# Altium schematic sheet Peripherals.SchDoc
size Legal
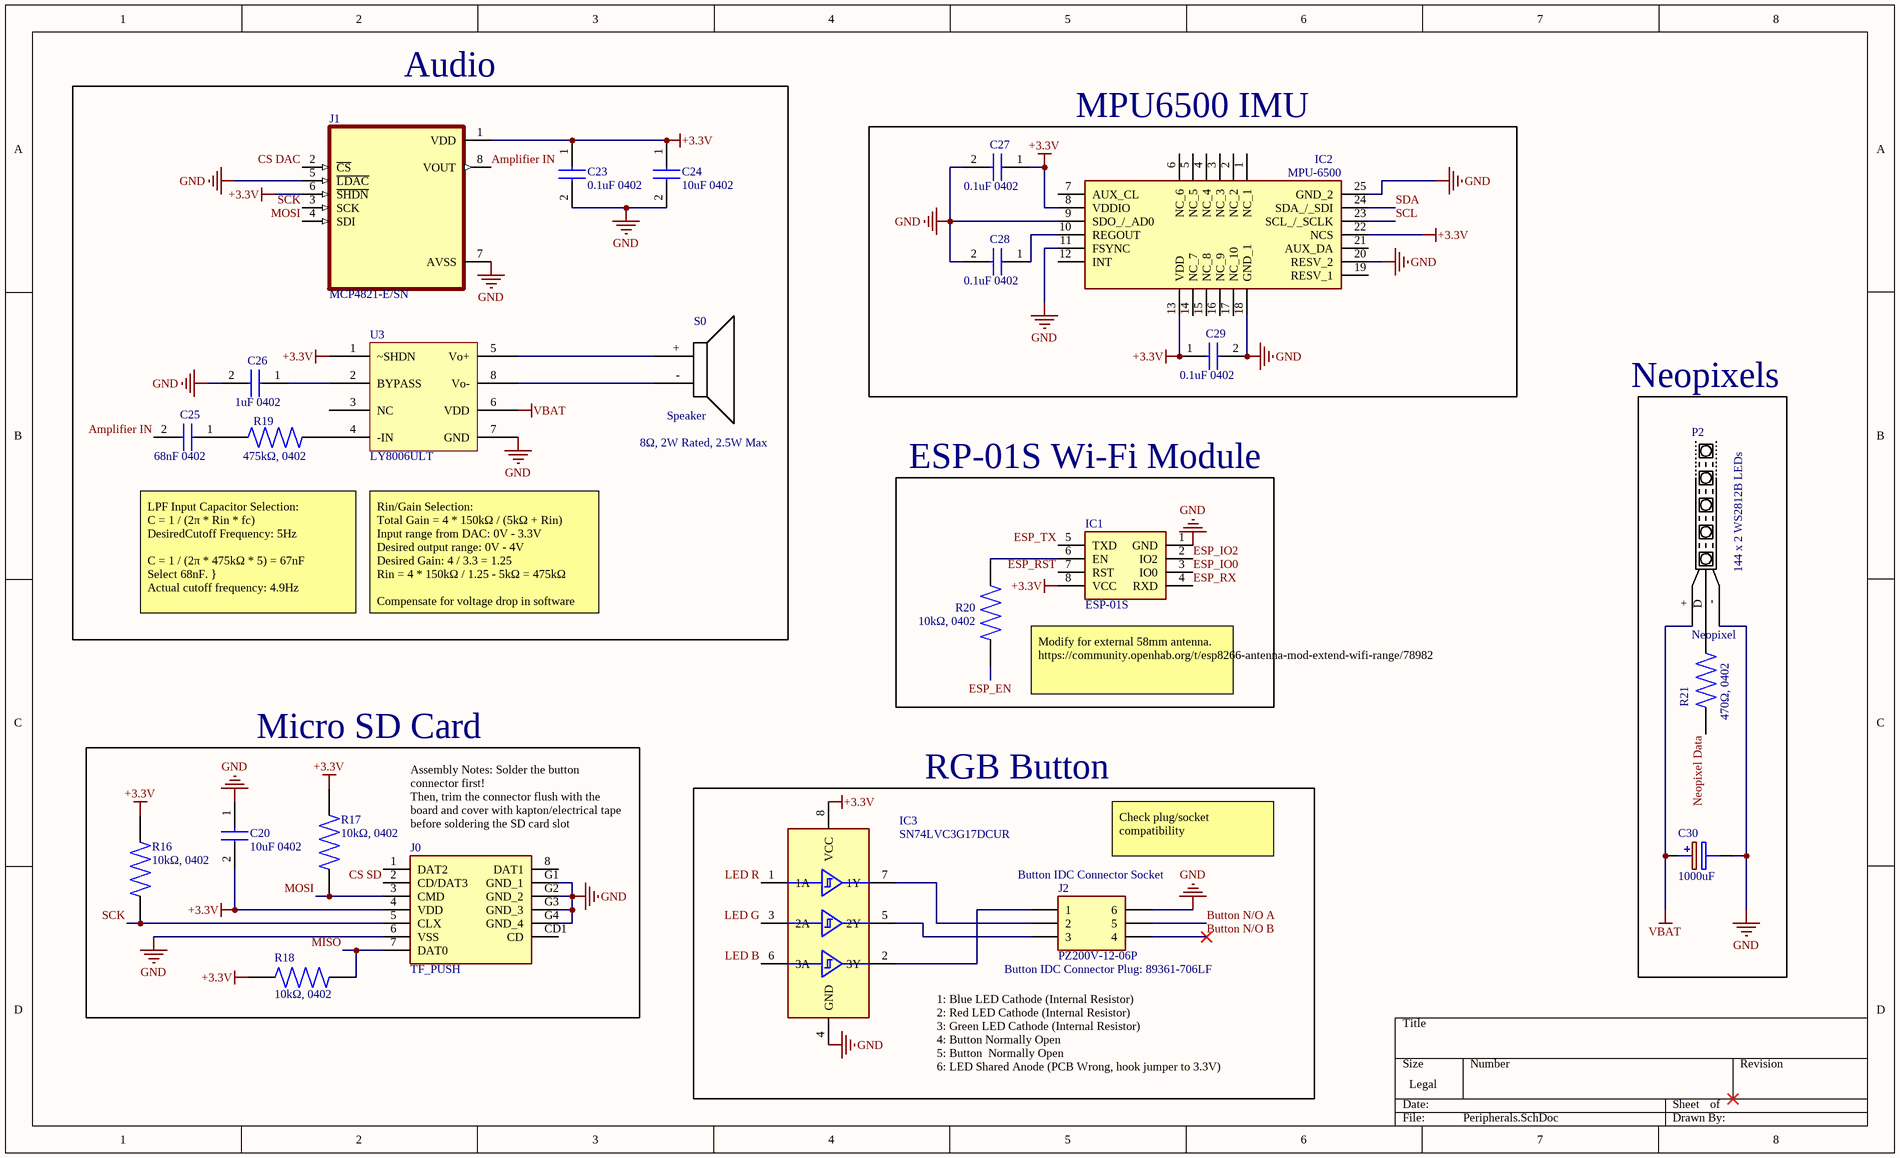
[diagram p0: Peripherals.SchDoc]

## Parts
C20  10uF 0402  [CAPC1005X56N]
C23  0.1uF 0402  [CAPC1005X56N]
C24  10uF 0402  [CAPC1005X56N]
C25  68nF 0402  [CAPC1005X56N]
C26  1uF 0402  [CAPC1005X56N]
C27  0.1uF 0402  [CAPC1005X56N]
C28  0.1uF 0402  [CAPC1005X56N]
C29  0.1uF 0402  [CAPC1005X56N]
C30  1000uF  [8x10.2mm Radial Capacitor]
IC1  ESP-01S  [ESP-01]
IC2  MPU-6500  [QFN-24]
IC3  SN74LVC3G17DCUR  [SOP50P310X90-8N]
J0  TF_PUSH  [TFPUSH]
J1  MCP4821-E/SN  [SOIC127P600X175-8N]
J2  PZ200V-12-06P  [2mm 2x3 Header TH]
P2  Neopixel  [Neopixel Pads]
R16  10kΩ, 0402  [0402]
R17  10kΩ, 0402  [0402]
R18  10kΩ, 0402  [0402]
R19  475kΩ, 0402  [0402]
R20  10kΩ, 0402  [0402]
R21  470Ω, 0402  [0402]
S0  Speaker  [SPEAKER PADS]
U3  LY8006ULT  [MSOP-8]

## Blocks framed on the sheet
Audio: C23-C26 J1 R19 S0 U3
MPU6500 IMU: C27-C29 IC2
Neopixels: C30 P2 R21
ESP-01S Wi-Fi Module: IC1 R20
Micro SD Card: C20 J0 R16-R18
RGB Button: IC3 J2

## Nets
+3.3V: C20.2 C23.1 C24.1 C27.1 C29.1 IC1.8(VCC) IC2.8(VDDIO) IC2.13(VDD) IC2.22(NCS) IC3.8(VCC) J0.4(VDD) J1.1(VDD) J1.6(~{SHDN}) R16.2 R17.2 R18.2 U3.1(~SHDN)
GND: C20.1 C23.2 C24.2 C26.2 C27.2 C28.2 C29.2 C30.2(-) IC1.1(GND) IC2.9(SDO_/_AD0) IC2.11(FSYNC) IC2.18(GND_1) IC2.20(RESV_2) IC2.25(GND_2) IC3.4(GND) J0.6(VSS) J0.G1(GND_1) J0.G2(GND_2) J0.G3(GND_3) J0.G4(GND_4) J1.5(~{LDAC}) J1.7(AVSS) J2.6 P2.- U3.7(GND)
VBAT: C30.1(+) P2.+ U3.6(VDD)
Amplifier IN: C25.2 J1.8(VOUT)
Button N/O A: J2.5
Button N/O B: J2.4
CS DAC: J1.2(~{CS})
CS SD: J0.2(CD/DAT3)
ESP_EN: R20.1
ESP_IO0: IC1.3(IO0)
ESP_IO2: IC1.2(IO2)
ESP_RST: IC1.7(RST)
ESP_RX: IC1.4(RXD)
ESP_TX: IC1.5(TXD)
LED B: IC3.6(3A)
LED G: IC3.3(2A)
LED R: IC3.1(1A)
MISO: J0.7(DAT0) R18.1
MOSI: J0.3(CMD) J1.4(SDI) R17.1
Neopixel Data: R21.2
SCK: J0.5(CLX) J1.3(SCK) R16.1
SCL: IC2.23(SCL_/_SCLK)
SDA: IC2.24(SDA_/_SDI)
NetC25_1: C25.1 R19.1
NetC26_1: C26.1 U3.2(BYPASS)
NetC28_1: C28.1 IC2.10(REGOUT)
NetIC1_6: IC1.6(EN) R20.2
NetIC3_2: IC3.2(3Y) J2.1
NetIC3_5: IC3.5(2Y) J2.3
NetIC3_7: IC3.7(1Y) J2.2
NetP2_D: P2.D R21.1
NetR19_2: R19.2 U3.4(-IN)
NetS0_+: S0.+ U3.5(Vo+)
NetS0_-: S0.- U3.8(Vo-)

Not connected (* = marked no-connect by the designer): IC2 1(NC_1) 2(NC_2) 3(NC_3) 4(NC_4) 5(NC_5) 6(NC_6) 7(AUX_CL) 12(INT) 14(NC_7) 15(NC_8) 16(NC_9) 17(NC_10) 19(RESV_1) 21(AUX_DA); J0 1(DAT2) 8(DAT1) CD1(CD); U3 3(NC)

## Notes on the sheet
- 8Ω, 2W Rated, 2.5W Max
- (near P2) 144 x 2 WS2812B LEDs
- LPF Input Capacitor Selection:
  C = 1 / (2π * Rin * fc)
  DesiredCutoff Frequency: 5Hz
  C = 1 / (2π * 475kΩ * 5) = 67nF
  Select 68nF. }
  Actual cutoff frequency: 4.9Hz
- Rin/Gain Selection:
  Total Gain = 4 * 150kΩ / (5kΩ + Rin)
  Input range from DAC: 0V - 3.3V
  Desired output range: 0V - 4V
  Desired Gain: 4 / 3.3 = 1.25
  Rin = 4 * 150kΩ / 1.25 - 5kΩ = 475kΩ
  Compensate for voltage drop in software
- Modify for external 58mm antenna.
  https://community.openhab.org/t/esp8266-antenna-mod-extend-wifi-range/78982
- (near J0) Assembly Notes: Solder the button connector first!
  Then, trim the connector flush with the board and cover with kapton/electrical tape before soldering the SD card slot
- (near J2) Button IDC Connector Socket
- Check plug/socket compatibility
- (near J2) Button IDC Connector Plug: 89361-706LF
- 1: Blue LED Cathode (Internal Resistor)
  2: Red LED Cathode (Internal Resistor)
  3: Green LED Cathode (Internal Resistor)
  4: Button Normally Open
  5: Button  Normally Open
  6: LED Shared Anode (PCB Wrong, hook jumper to 3.3V)

## Library data of the parts
C20 C23-C29 = 04025A100BAT2A: Capacitor; Manufacturer_Name: AVX; Datasheet Link: http://www.mouser.com/catalog/supplier/library/pdf/AVXSurfaceMountCeramic.pdf; Height: 0.56mm; Manufacturer_Part_Number: 04025A100BAT2A; Arrow Part Number: 04025A100BAT2A; Arrow Price/Stock: https://www.arrow.com/en/products/04025a100bat2a/avx; Mouser Part Number: 581-04025A100B; Mouser Price/Stock: https://www.mouser.com/Search/Refine.aspx?Keyword=581-04025A100B
C30 = 8x10.2mm Radial Capacitor: Capacitor Polarised; Manufacturer_Name: Cinch Connectivity Solutions; Manufacturer_Part_Number: 107CKS035M; Datasheet Link: http://www.farnell.com/datasheets/1912641.pdf; Height: 12.5mm
IC1 = ESP-01S: Integrated Circuit; Manufacturer_Name: Ai-Thinker; Datasheet Link: http://wiki.ai-thinker.com/_media/esp8266/esp8266_series_modules_user_manual_v1.1.pdf; Height: 2mm; Manufacturer_Part_Number: ESP-01
IC2 = MPU-6500: Integrated Circuit; Manufacturer_Name: TDK; Datasheet Link: https://www.invensense.com/wp-content/uploads/2015/02/MPU-6500-Datasheet2.pdf; Height: 0.95mm; Manufacturer_Part_Number: MPU-6500; Arrow Part Number: MPU-6500; Arrow Price/Stock: https://www.arrow.com/en/products/mpu-6500/invensense; Mouser Part Number: 410-MPU-6500
IC3 = SN74LVC3G17DCUR: Integrated Circuit; Manufacturer_Name: Texas Instruments; Datasheet Link: http://www.ti.com/lit/ds/symlink/sn74lvc3g17.pdf; Height: 0.9mm; Manufacturer_Part_Number: SN74LVC3G17DCUR; Arrow Part Number: SN74LVC3G17DCUR; Arrow Price/Stock: https://www.arrow.com/en/products/sn74lvc3g17dcur/texas-instruments; Mouser Part Number: 595-SN74LVC3G17DCUR; Mouser Price/Stock: https://www.mouser.co.uk/ProductDetail/Texas-Instruments/SN74LVC3G17DCUR?qs=0smPjiIwnfJ%2FZmnYCRa%2FdA%3D%3D
J0 = TF_PUSH: Connector; Manufacturer_Name: Shou Han; Manufacturer_Part_Number: TF PUSH; Datasheet Link: https://datasheet.lcsc.com/szlcsc/1912111437_SHOU-HAN-TF-PUSH_C393941.pdf; Height: 2mm
J1 = MCP4821-E/SN: MF: {'manufacturer': u'Microchip'}; MP: MCP4821-E/SN; Price: None; Availability: Unavailable; Value: *; Package: None
J2 = PZ200V-12-06P: Connector; Manufacturer_Name: Amphenol; Manufacturer_Part_Number: 54202-G08-03; Datasheet Link: https://cdn.amphenol-icc.com/media/wysiwyg/files/drawing/54202.pdf; Height: 9.85mm; Arrow Part Number: 54202-G08-03; Arrow Price/Stock: https://www.arrow.com/en/products/54202-g08-03/amphenol-fci; Mouser Part Number: 649-54202-G08-03; Mouser Price/Stock: https://www.mouser.co.uk/ProductDetail/Amphenol-FCI/54202-G08-03?qs=GN3JspNYOhaVPFh0SDYuCQ%3D%3D
R16-R21 = Resistor, 0402